# EAGLE schematic untitled (EAGLE 6.1)
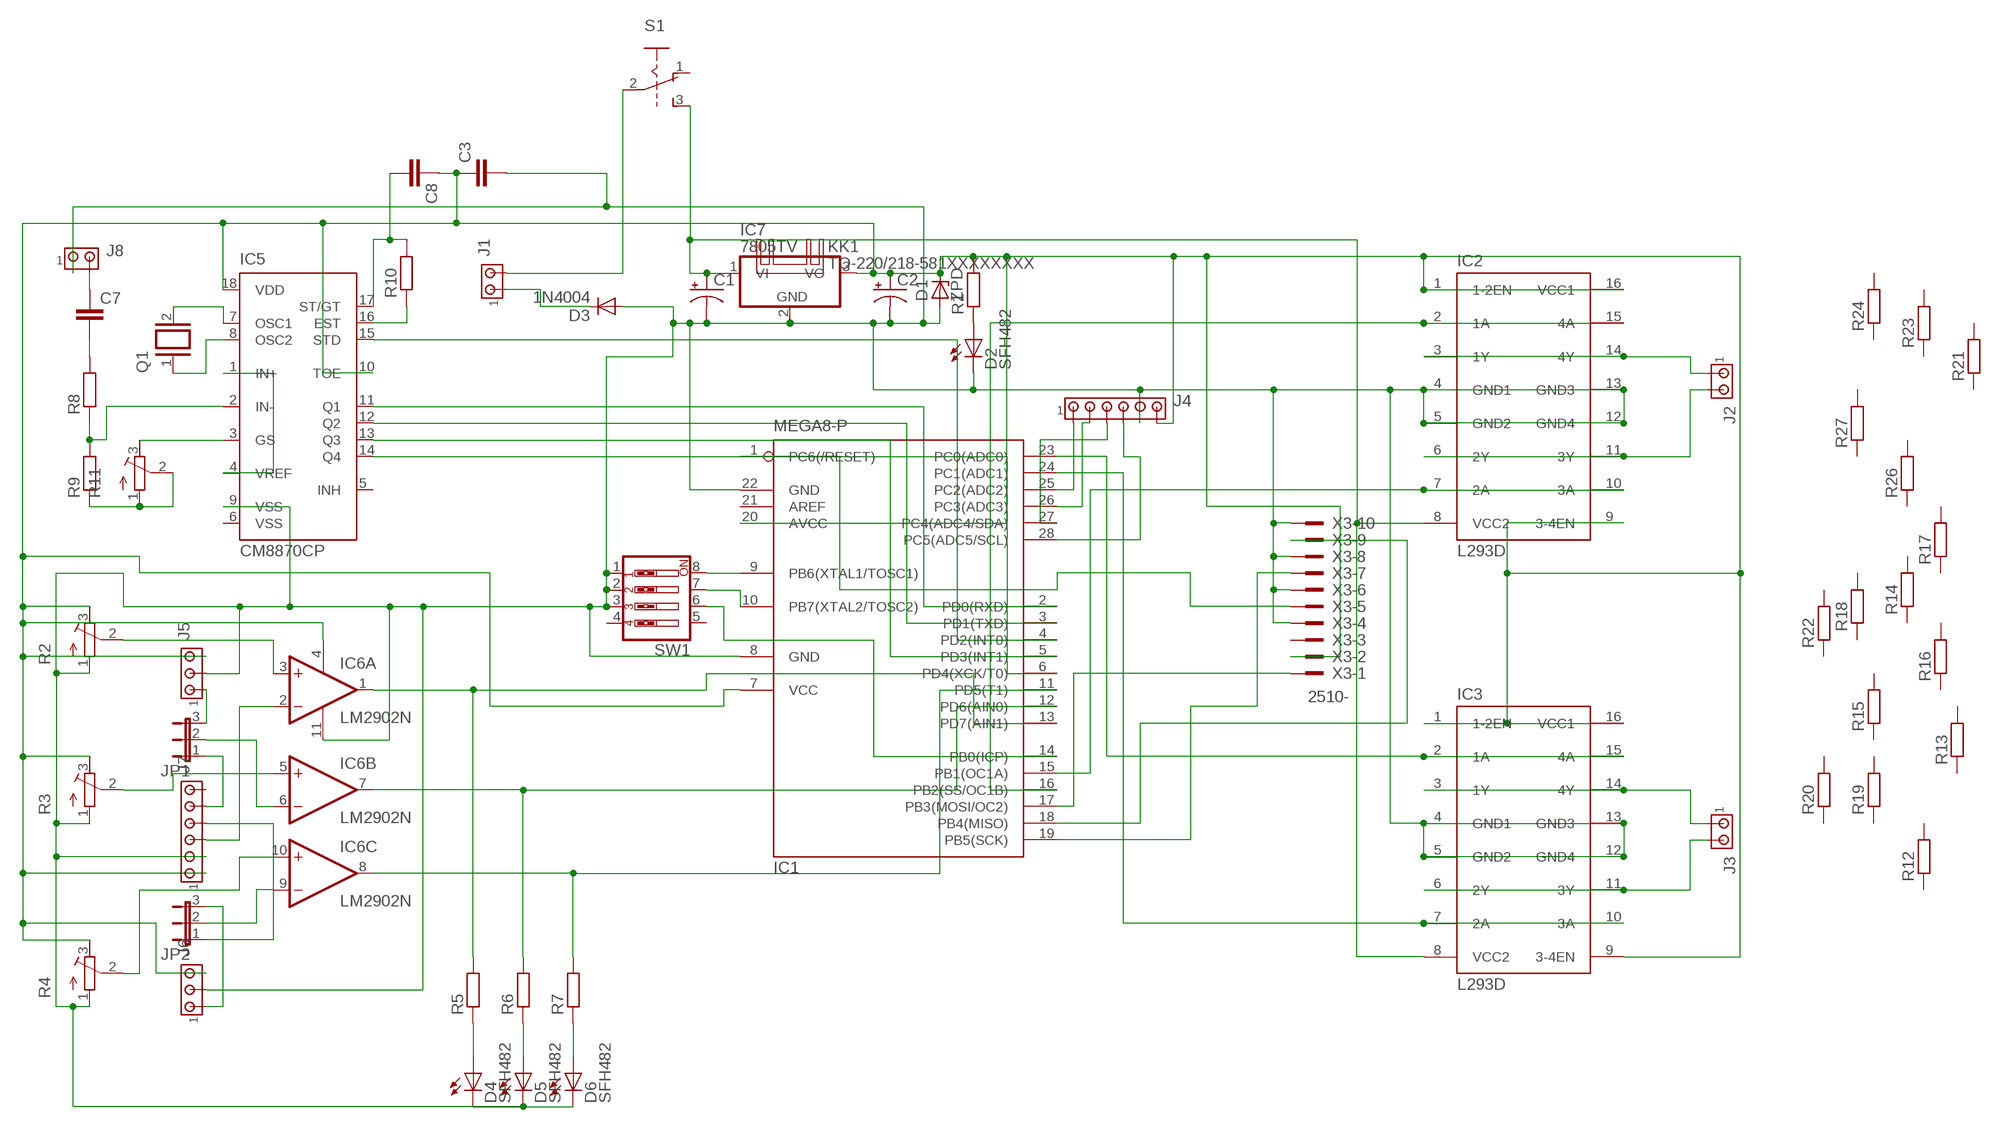
[diagram p0: schematic, sheet 1]

## Parts
C1  CPOL-USE5-10.5  [E5-10,5]
C2  CPOL-USE5-10.5  [E5-10,5]
C3  C2.5/2  [C2.5-2]
C7  C5/2.5  [C5B2.5]
C8  C5/2.5  [C5B2.5]
D1  ZPD  [DO35Z10]
D2  SFH482  [SFH482]
D3  1N4004  [DO41-10]
D4  SFH482  [SFH482]
D5  SFH482  [SFH482]
D6  SFH482  [SFH482]
IC1  MEGA8-P  [DIL28-3]
IC2  L293D  [DIL16]
IC3  L293D  [DIL16]
IC5  CM8870CP  [DIL18]
IC6  LM2902N  [DIL14]
IC7  7805TV  [TO220V]
J1  MTA02-100  [10X02MTA]
J2  MTA02-156  [1X2MTA]
J3  MTA02-156  [1X2MTA]
J4  MTA06-100  [10X06MTA]
J5  MTA03-100  [10X03MTA]
J6  MTA03-100  [10X03MTA]
J7  MTA06-100  [10X06MTA]
J8  MTA02-100  [10X02MTA]
JP1  JP2E  [JP2]
JP2  JP2E  [JP2]
KK1  TO-220/218-581XXXXXXXX  [581XXXXXXXX]
Q1  XTAL/S  [QS]
R1  R-EU_0207/10  [0207/10]
R2  R-TRIMM3296W  [RTRIM3296W]
R3  R-TRIMM3296W  [RTRIM3296W]
R4  R-TRIMM3296W  [RTRIM3296W]
R5  R-EU_0207/10  [0207/10]
R6  R-EU_0207/10  [0207/10]
R7  R-EU_0207/10  [0207/10]
R8  R-EU_0207/10  [0207/10]
R9  R-EU_0207/10  [0207/10]
R10  R-EU_0207/10  [0207/10]
R11  R-TRIMM3296W  [RTRIM3296W]
R12  R-EU_0207/10  [0207/10]
R13  R-EU_0204/7  [0204/7]
R14  R-EU_0204/7  [0204/7]
R15  R-EU_0204/7  [0204/7]
R16  R-EU_0204/7  [0204/7]
R17  R-EU_0204/7  [0204/7]
R18  R-EU_0204/7  [0204/7]
R19  R-EU_0204/7  [0204/7]
R20  R-EU_0204/7  [0204/7]
R21  R-EU_0207/12  [0207/12]
R22  R-EU_0204/7  [0204/7]
R23  R-EU_0207/12  [0207/12]
R24  R-EU_0207/12  [0207/12]
R26  R-EU_0204/7  [0204/7]
R27  R-EU_0204/7  [0204/7]
S1  A68-A31  [A68-A31]
SW1  SW_DIP-4  [EDG-04]
X3  2510-  [PAK100/2500-10]

## Nets
N$1: IC1.16(PB2(SS/OC1B)) IC2.2(1A) IC2.15(4A)
N$2: IC2.3(1Y) IC2.14(4Y) J2.1
N$3: IC1.9(PB6(XTAL1/TOSC1)) SW1.8
N$4: IC1.13(PD7(AIN1)) IC6.1(A:OUT) R5.2
N$5: IC2.6(2Y) IC2.11(3Y) J2.2
N$6: IC1.15(PB1(OC1A)) IC2.7(2A) IC2.10(3A)
N$7: IC1.23(PC0(ADC0)) IC3.2(1A) IC3.15(4A)
N$8: IC3.3(1Y) IC3.14(4Y) J3.1
N$9: IC1.17(PB3(MOSI/OC2)) X3.1
N$10: D2.A R1.1
N$11: IC3.6(2Y) IC3.11(3Y) J3.2
N$12: IC1.24(PC1(ADC1)) IC3.7(2A) IC3.10(3A)
N$13: IC1.1(PC6(/RESET)) X3.5
N$14: IC1.19(PB5(SCK)) X3.7
N$15: D4.A R5.1
N$16: IC1.18(PB4(MISO)) X3.9
N$17: IC1.25(PC2(ADC2)) J4.6
N$18: IC1.26(PC3(ADC3)) J4.5
N$19: IC1.27(PC4(ADC4/SDA)) J4.4
N$20: IC1.28(PC5(ADC5/SCL)) J4.3
N$21: C1.+ IC2.8(VCC2) IC3.8(VCC2) IC7.1(VI) S1.3(A:S)
N$23: IC1.10(PB7(XTAL2/TOSC2)) SW1.7
N$24: IC1.14(PB0(ICP)) SW1.6
N$25: J5.1 JP1.3
N$26: IC6.2(A:-IN) J7.4
N$27: IC6.6(B:-IN) JP1.2
N$28: IC6.9(C:-IN) JP2.2
N$29: IC6.3(A:+IN) R2.2(S)
N$30: IC6.5(B:+IN) R3.2(S)
N$31: IC6.10(C:+IN) R4.2(S)
N$32: IC1.5(PD3(INT1)) IC5.13(Q3)
N$33: IC5.7(OSC1) Q1.2
N$34: D5.A R6.1
N$35: D6.A R7.1
N$36: C1.- C2.- C3.2 D1.A D2.K(C) D3.A D4.K(C) D5.K(C) D6.K(C) IC1.8(GND) IC1.22(GND) IC2.4(GND1) IC2.5(GND2) IC2.12(GND4) IC2.13(GND3) IC3.4(GND1) IC3.5(GND2) IC3.12(GND4) IC3.13(GND3) IC5.9(VSS) IC6.11(P:V-) IC7.2(GND) J4.2 J5.2 J6.2 J7.5 J8.1 R2.1(E) R3.1(E) R4.1(E) SW1.1 SW1.2 SW1.3 X3.4 X3.6 X3.8 X3.10
N$37: IC1.12(PD6(AIN0)) IC6.7(B:OUT) R6.2
N$38: IC1.11(PD5(T1)) IC6.8(C:OUT) R7.2
N$39: IC5.8(OSC2) Q1.1
N$40: J7.3 JP2.1
N$41: J7.2 JP1.1
N$42: J1.2 S1.2(A:P)
N$43: J6.1 JP2.3
N$44: IC5.1(IN+) IC5.4(VREF)
N$45: IC1.2(PD0(RXD)) IC5.11(Q1)
N$46: IC1.3(PD1(TXD)) IC5.12(Q2)
N$47: IC1.6(PD4(XCK/T0)) IC5.14(Q4)
N$48: IC1.4(PD2(INT0)) IC5.15(STD)
N$49: R9.1 R11.1(E) R11.2(S)
N$50: C7.1 J8.2
N$51: C7.2 R8.2
N$52: IC5.2(IN-) R8.1 R9.2
N$53: C2.+ C3.1 C8.1 D1.C IC1.7(VCC) IC1.20(AVCC) IC2.1(1-2EN) IC2.9(3-4EN) IC2.16(VCC1) IC3.1(1-2EN) IC3.9(3-4EN) IC3.16(VCC1) IC5.10(TOE) IC5.18(VDD) IC6.4(P:V+) IC7.3(VO) J4.1 J5.3 J6.3 J7.6 R1.2 R2.3(A) R3.3(A) R4.3(A) X3.2
N$54: IC5.3(GS) R11.3(A)
N$55: C8.2 IC5.17(ST/GT) R10.2
N$56: IC5.16(EST) R10.1
N$57: D3.C J1.1
Unconnected: IC1.21(AREF) IC5.5(INH) IC6.12(D:+IN) IC6.13(D:-IN) IC6.14(D:OUT) J7.1 R12.1 R12.2 R13.1 R13.2 R14.1 R14.2 R15.1 R15.2 R16.1 R16.2 R17.1 R17.2 R18.1 R18.2 R19.1 R19.2 R20.1 R20.2 R21.1 R21.2 R22.1 R22.2 R23.1 R23.2 R24.1 R24.2 R26.1 R26.2 R27.1 R27.2 S1.1(A:O) S1.4(B:O) S1.5(B:P) S1.6(B:S) SW1.4 SW1.5 X3.3

## Power pins joined to a net without a drawn wire
VSS: IC5.6(VSS)

## Library data of the parts
C1 C2 = resistor:CPOL-US: POLARIZED CAPACITOR, American symbol
C3 C7 C8 = capacitor-wima:C: CAPACITOR naming: grid - package width
D1 = diode:ZPD: Z DIODE 500 mW
D2 D4-D6 = led:SFH482: IR LED infrared emitting diode, Infineon
D3 = diode:1N4004: DIODE general purpose rectifier, 1 A
IC1 = atmel:MEGA8-P: MICROCONTROLLER 8 Kbytes FLASH, 1 kbytes SRAM, 512 bytes EEPROM, USART, 4-channel 10 bit ADC, 2-channel 8 bit ADC Pin compatible with Atmega48, ATMega88, ATMega168 Source: avr.lbr
IC2 IC3 = st-microelectronics:L293D: PUSH-PULL 4 CHANNEL DRIVER
IC5 = california-micro-devices:CM8870C: CMOS Integrated DTMF Receiver cm8870.pdf
IC6 = linear:LM2902: COMPARATOR
IC7 = linear:78*: Positive VOLTAGE REGULATOR Source: http://cache.national.com/ds/LM/LM78L05.pdf http://www.fairchildsemi.com/ds/LM/LM7805.pdf
J1 J8 = con-amp:MTA02-100: AMP connector
J2 J3 = con-amp:MTA02-156: AMP connector
J4 J7 = con-amp:MTA06-100: AMP connector
J5 J6 = con-amp:MTA03-100: AMP connector
JP1 JP2 = jumper:JP2E: JUMPER
KK1 = heatsink-aavid:TO-220/218: HEATSINKS TO-220/218
Q1 = special:XTAL/S: CRYSTAL
R1 R5-R7 = resistor:R-EU_: RESISTOR, European symbol
R2-R4 R11 = resistor:R-TRIMM: Trimm resistor
R8-R10 R12-R24 R26 R27 = rcl:R-EU_: RESISTOR, European symbol
S1 = switch:A68-A31: SLIDING SWITCH Siemens, distributor Buerklin, 11G766
SW1 = special:SW_DIP-4: DIP SWITCH
X3 = con-3m:2510-: 3M (TM) Pak 100 4-Wall Header Source: 3M